# Altium schematic sheet US_EPS_RS485.SchDoc
size A4
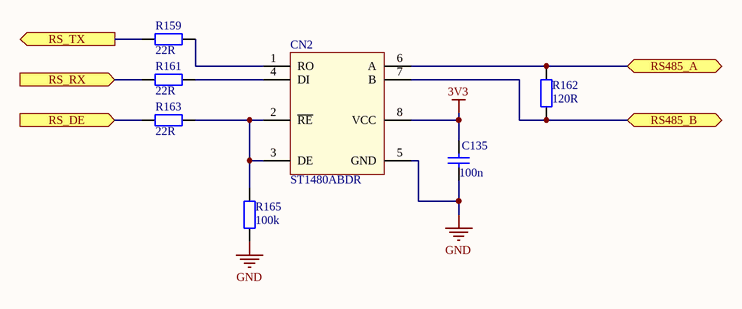
[diagram p0: US_EPS_RS485.SchDoc]

## Parts
C135  100n  [C0603_IPC_HD]
CN2  ST1480ABDR  [SOIC-8]
R159  22R  [R0603_IPC_MD]
R161  22R  [R0603_IPC_MD]
R162  120R  [C0603_IPC_MD]
R163  22R  [R0603_IPC_MD]
R165  100k  [R0603_IPC_MD]

## Ports
RS485_A (bidir), RS485_B (bidir), RS_DE (in), RS_RX (in), RS_TX (out)

## Nets
3V3: C135.2 CN2.8(VCC)
GND: C135.1 CN2.5(GND) R165.1
RS485_A: CN2.6(A) R162.2 ; port RS485_A
RS485_B: CN2.7(B) R162.1 ; port RS485_B
RS_DE: R163.1 ; port RS_DE
RS_RX: R161.1 ; port RS_RX
RS_TX: R159.1 ; port RS_TX
NetCN2_1: CN2.1(RO) R159.2
NetCN2_2: CN2.2(~{RE}) CN2.3(DE) R163.2 R165.2
NetCN2_4: CN2.4(DI) R161.2

## Library data of the parts
C135 = CL10B104KO8NNNC: CAP CER 0.1UF 16V X7R 0603; Manufacturer: Samsung Electro-Mechanics; Manufacturer Part Number: CL10B104KO8NNNC; Voltage: 16V; Value: 100n; Dielectric: X7R; Supplier 1: Digi-Key; Supplier Part Number 1: 1276-1005-1-ND
CN2 = ST1480ABDR: IC TXRX 3.3V RS485/422 8 SOIC; Manufacturer: STMicroelectronics; Manufacturer Part Number: ST1480ABDR; Supplier 1: Digi-Key; Supplier Part Number 1: 497-2046-1-ND
R159 R161 R163 = CR0603-JW-220ELF: RES SMD 22 OHM 5% 1/10W 0603; Manufacturer: Bourns Inc.; Value: 22R; Tolarance: 5%; Manufacturer Part Number: CR0603-JW-220ELF; Supplier 1: Digi-Key; Supplier Part Number 1: CR0603-JW-220ELFCT-ND
R162 = RC0603JR-07120RL: RES SMD 120 OHM 5% 1/10W 0603; Manufacturer: Yageo; Value: 120R; Tolarance: 5%; Manufacturer Part Number: RC0603JR-07120RL; Supplier 1: Digi-Key; Supplier Part Number 1: 311-120GRCT-ND
R165 = CR0603-JW-104ELF: RES 100K OHM 1% 1/10W 0603; Manufacturer: Stackpole Electronics Inc; Manufacturer Part Number: RMCF0603FT100K; Value: 100k; Tolarance: ±1%; Supplier 1: Digi-Key; Supplier Part Number 1: RMCF0603FT100KCT-ND